# Altium schematic sheet hdmi.SchDoc
size A4
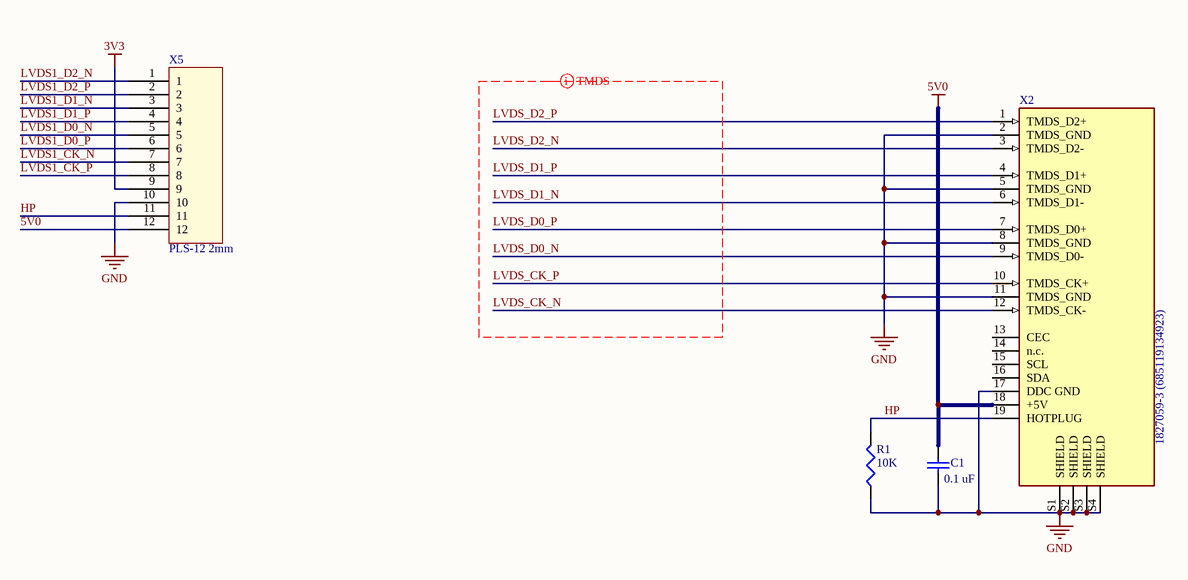
[diagram p0: hdmi.SchDoc]

## Parts
C1  0.1 uF  [0805 chip cap]
R1  10K  [0805 CHIP RES]
X2  1827059-3 (685119134923)  [1827059-3 (685119134923)]
X5  PLS-12 2mm  [PLS-12 2MM]

## Nets
3V3: X5.9
5V0: C1.2 X2.18(+5V) X5.12
GND: C1.1 R1.1 X2.2(TMDS_GND) X2.5(TMDS_GND) X2.8(TMDS_GND) X2.11(TMDS_GND) X2.17(DDC_GND) X2.S1(SHIELD) X2.S2(SHIELD) X2.S3(SHIELD) X2.S4(SHIELD) X5.10
HP: R1.2 X2.19(HOTPLUG) X5.11
LVDS1_CK_N: X5.7
LVDS1_CK_P: X5.8
LVDS1_D0_N: X5.5
LVDS1_D0_P: X5.6
LVDS1_D1_N: X5.3
LVDS1_D1_P: X5.4
LVDS1_D2_N: X5.1
LVDS1_D2_P: X5.2
LVDS_CK_N: X2.12(TMDS_CK-)
LVDS_CK_P: X2.10(TMDS_CK+)
LVDS_D0_N: X2.9(TMDS_D0-)
LVDS_D0_P: X2.7(TMDS_D0+)
LVDS_D1_N: X2.6(TMDS_D1-)
LVDS_D1_P: X2.4(TMDS_D1+)
LVDS_D2_N: X2.3(TMDS_D2-)
LVDS_D2_P: X2.1(TMDS_D2+)

Not connected (* = marked no-connect by the designer): X2 13(CEC) 14(n.c.) 15(SCL) 16(SDA)

## Layout directives
differential pair; differential pair class TDMS_DIFF; net class TDMS: LVDS_CK_N, LVDS_CK_P, LVDS_D0_N, LVDS_D0_P, LVDS_D1_N, LVDS_D1_P, LVDS_D2_N, LVDS_D2_P

## Library data of the parts
C1 = Cap: Capacitor; Value: 0.1 uF
R1 = CHIP RES: Resistor; Value: 10K
X2 = 1827059-3 (685119134923): HDMI Connector | Right Angle | Without Flange | -20C to 85C / 1827059-3 / KLS1-285-1-N-1-R / 1747981-1 / 685119134923; MP: SS-53000-001; MF: Stewart Connector; Price: None; SnapEDA_Link: https://www.snapeda.com/parts/SS-53000-001/Stewart%20Connector/view-part/4628816/?ref=snap; Availability: Unavailable; Value: *; Package: None